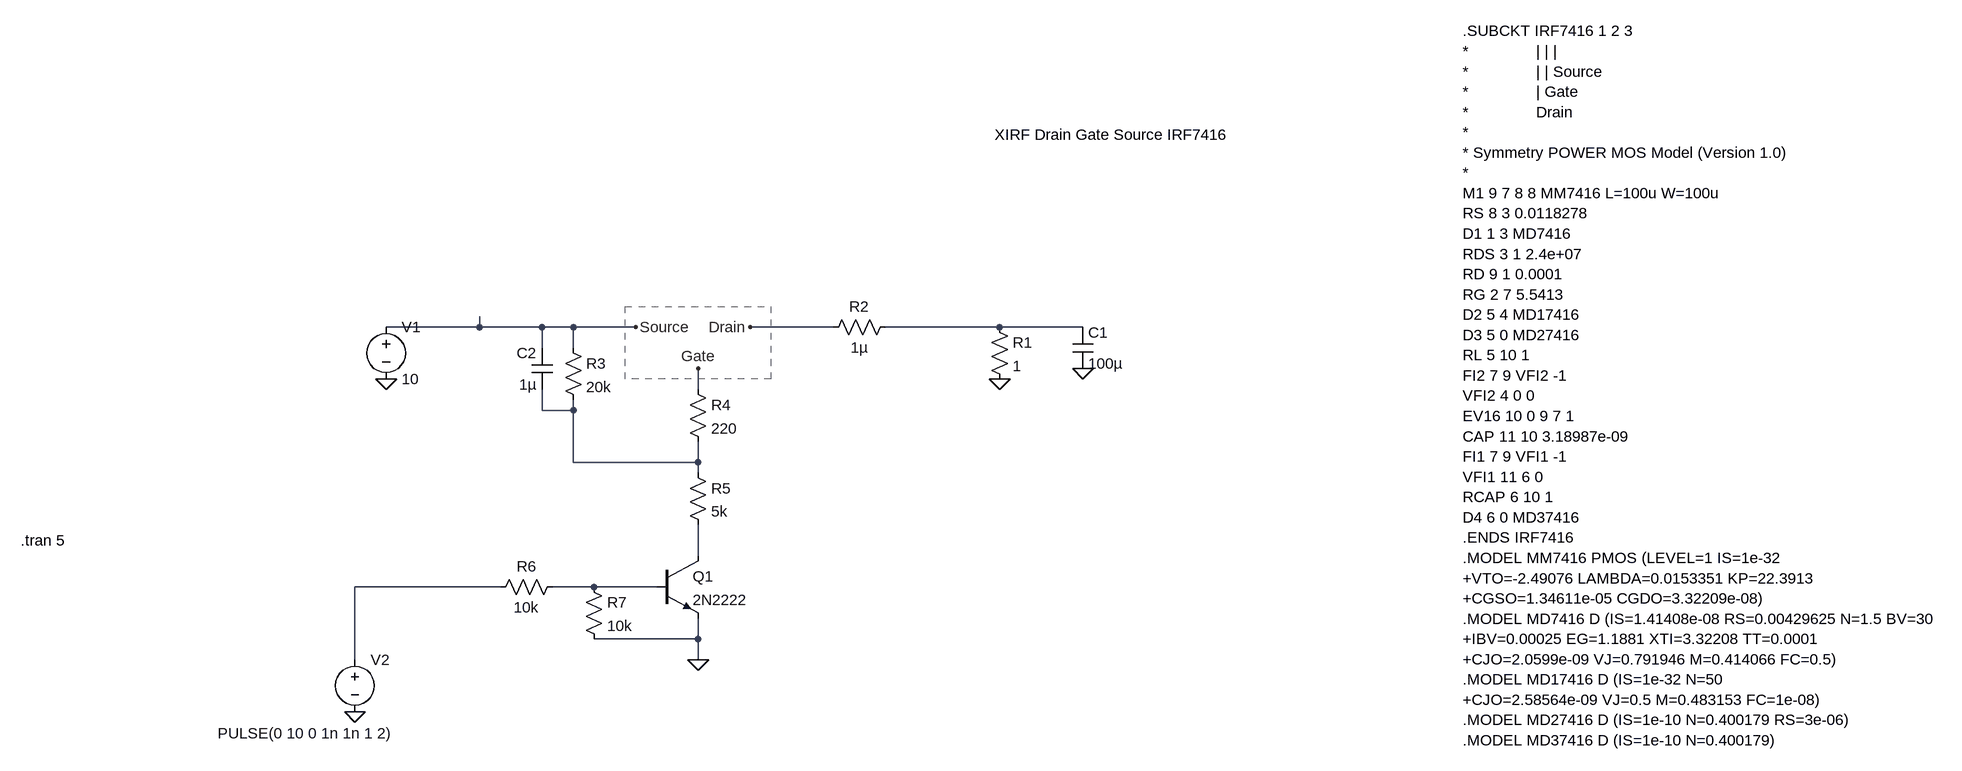
[diagram p0: schematic inrush_current.asc]
inrush_current.asc, the LTspice schematic file:
Version 4
SHEET 1 960 1096
WIRE -1488 128 -1488 112
WIRE -1488 128 -1632 128
WIRE -1392 128 -1488 128
WIRE -1344 128 -1392 128
WIRE -1248 128 -1344 128
WIRE -944 128 -1072 128
WIRE -688 128 -864 128
WIRE -560 128 -688 128
WIRE -1392 160 -1392 128
WIRE -1344 160 -1344 128
WIRE -1152 224 -1152 192
WIRE -1392 256 -1392 224
WIRE -1344 256 -1344 240
WIRE -1344 256 -1392 256
WIRE -1344 336 -1344 256
WIRE -1152 336 -1152 304
WIRE -1152 336 -1344 336
WIRE -1152 352 -1152 336
WIRE -1152 480 -1152 432
WIRE -1456 528 -1680 528
WIRE -1312 528 -1376 528
WIRE -1216 528 -1312 528
WIRE -1152 608 -1152 576
WIRE -1152 608 -1312 608
WIRE -1680 640 -1680 528
WIRE -1152 640 -1152 608
FLAG -1072 128 Drain
FLAG -1152 192 Gate
FLAG -1248 128 Source
FLAG -1632 208 0
FLAG -1680 720 0
FLAG -688 208 0
FLAG -560 192 0
FLAG -1152 640 0
SYMBOL voltage -1632 112 R0
WINDOW 123 0 0 Left 2
WINDOW 39 0 0 Left 2
SYMATTR InstName V1
SYMATTR Value 10
SYMBOL voltage -1680 624 R0
WINDOW 3 -211 129 Left 2
WINDOW 123 0 0 Left 2
WINDOW 39 0 0 Left 2
SYMATTR InstName V2
SYMATTR Value PULSE(0 10 0 1n 1n 1 2)
SYMBOL res -704 112 R0
SYMATTR InstName R1
SYMATTR Value 1
SYMBOL cap -576 128 R0
SYMATTR InstName C1
SYMATTR Value 100µ
SYMBOL res -1360 144 R0
SYMATTR InstName R3
SYMATTR Value 20k
SYMBOL cap -1376 224 R180
WINDOW 0 24 56 Left 2
WINDOW 3 24 8 Left 2
SYMATTR InstName C2
SYMATTR Value 1µ
SYMBOL npn -1216 480 R0
SYMATTR InstName Q1
SYMATTR Value 2N2222
SYMBOL res -1168 208 R0
SYMATTR InstName R4
SYMATTR Value 220
SYMBOL res -1168 336 R0
SYMATTR InstName R5
SYMATTR Value 5k
SYMBOL res -1360 512 R90
WINDOW 0 0 56 VBottom 2
WINDOW 3 32 56 VTop 2
SYMATTR InstName R6
SYMATTR Value 10k
SYMBOL res -848 112 R90
WINDOW 0 0 56 VBottom 2
WINDOW 3 32 56 VTop 2
SYMATTR InstName R2
SYMATTR Value 1µ
SYMBOL res -1328 512 R0
SYMATTR InstName R7
SYMATTR Value 10k
TEXT 24 -328 Left 2 !.SUBCKT IRF7416 1 2 3\n*               | | |\n*               | | Source\n*               | Gate\n*               Drain\n*\n* Symmetry POWER MOS Model (Version 1.0)\n*\nM1 9 7 8 8 MM7416 L=100u W=100u\nRS 8 3 0.0118278\nD1 1 3 MD7416\nRDS 3 1 2.4e+07\nRD 9 1 0.0001\nRG 2 7 5.5413\nD2 5 4 MD17416\nD3 5 0 MD27416\nRL 5 10 1\nFI2 7 9 VFI2 -1\nVFI2 4 0 0\nEV16 10 0 9 7 1\nCAP 11 10 3.18987e-09\nFI1 7 9 VFI1 -1\nVFI1 11 6 0\nRCAP 6 10 1\nD4 6 0 MD37416\n.ENDS IRF7416\n.MODEL MM7416 PMOS (LEVEL=1 IS=1e-32\n+VTO=-2.49076 LAMBDA=0.0153351 KP=22.3913\n+CGSO=1.34611e-05 CGDO=3.32209e-08)\n.MODEL MD7416 D (IS=1.41408e-08 RS=0.00429625 N=1.5 BV=30\n+IBV=0.00025 EG=1.1881 XTI=3.32208 TT=0.0001\n+CJO=2.0599e-09 VJ=0.791946 M=0.414066 FC=0.5)\n.MODEL MD17416 D (IS=1e-32 N=50\n+CJO=2.58564e-09 VJ=0.5 M=0.483153 FC=1e-08)\n.MODEL MD27416 D (IS=1e-10 N=0.400179 RS=3e-06)\n.MODEL MD37416 D (IS=1e-10 N=0.400179)
TEXT -696 -168 Left 2 !XIRF Drain Gate Source IRF7416
TEXT -2194 456 Left 2 !.tran 5
RECTANGLE Normal -1040 208 -1264 96 2

The netlist it stands for:
* inrush_current.asc
V1 Source 0 10
V2 N004 0 PULSE(0 10 0 1n 1n 1 2)
R1 N001 0 1
C1 N001 0 100µ
R3 Source N002 20k
C2 N002 Source 1µ
Q1 N003 N005 0 0 2N2222
R4 Gate N002 220
R5 N002 N003 5k
R6 N005 N004 10k
R2 N001 Drain 1µ
R7 N005 0 10k
.model NPN NPN
.model PNP PNP
.lib standard.bjt
.SUBCKT IRF7416 1 2 3
*               | | |
*               | | Source
*               | Gate
*               Drain
*
* Symmetry POWER MOS Model (Version 1.0)
*
M1 9 7 8 8 MM7416 L=100u W=100u
RS 8 3 0.0118278
D1 1 3 MD7416
RDS 3 1 2.4e+07
RD 9 1 0.0001
RG 2 7 5.5413
D2 5 4 MD17416
D3 5 0 MD27416
RL 5 10 1
FI2 7 9 VFI2 -1
VFI2 4 0 0
EV16 10 0 9 7 1
CAP 11 10 3.18987e-09
FI1 7 9 VFI1 -1
VFI1 11 6 0
RCAP 6 10 1
D4 6 0 MD37416
.ENDS IRF7416
.MODEL MM7416 PMOS (LEVEL=1 IS=1e-32
+VTO=-2.49076 LAMBDA=0.0153351 KP=22.3913
+CGSO=1.34611e-05 CGDO=3.32209e-08)
.MODEL MD7416 D (IS=1.41408e-08 RS=0.00429625 N=1.5 BV=30
+IBV=0.00025 EG=1.1881 XTI=3.32208 TT=0.0001
+CJO=2.0599e-09 VJ=0.791946 M=0.414066 FC=0.5)
.MODEL MD17416 D (IS=1e-32 N=50
+CJO=2.58564e-09 VJ=0.5 M=0.483153 FC=1e-08)
.MODEL MD27416 D (IS=1e-10 N=0.400179 RS=3e-06)
.MODEL MD37416 D (IS=1e-10 N=0.400179)
XIRF Drain Gate Source IRF7416
.tran 5
.backanno
.end